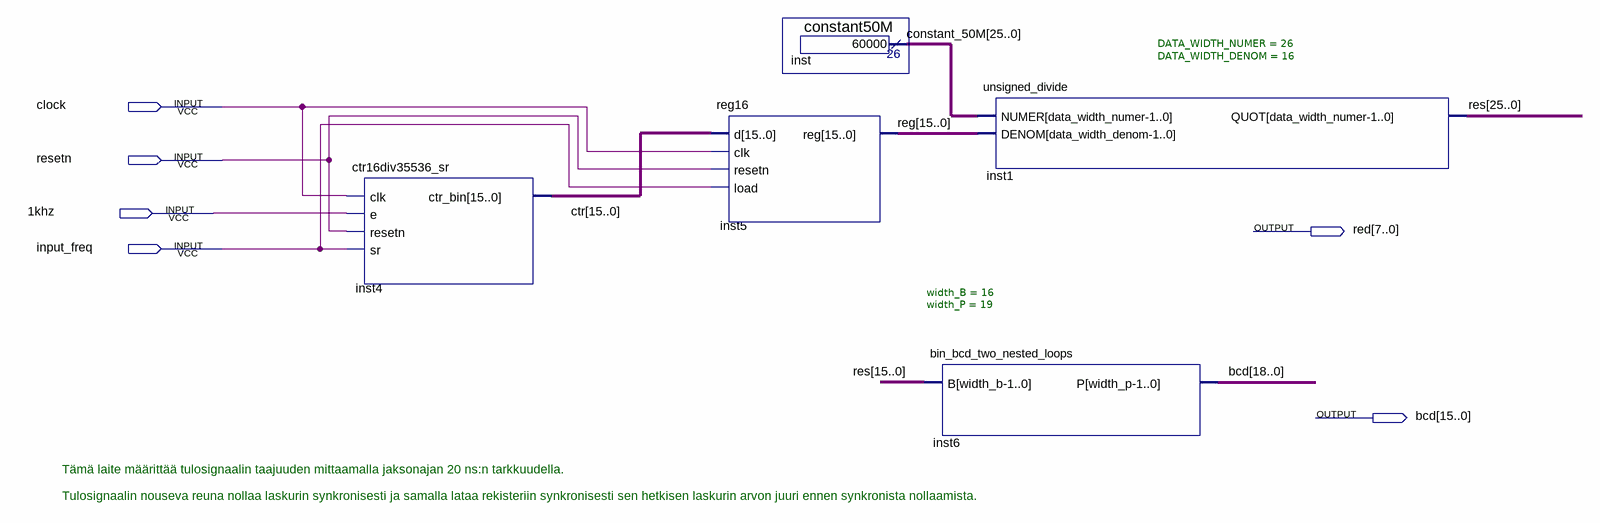
[diagram p0: schematic sheet]
// Quartus schematic freq_counter.bdf as structural Verilog: 5 symbols, 6 pins
module freq_counter (
  input  clock,
  input  resetn,
  input  \1khz ,
  input  input_freq,
  output [7:0] red,
  output [18:0] bcd
);

  wire [15:0] ctr, \reg ;
  wire [25:0] constant_50M, res;

  ctr16div35536_sr inst4 (.clk(clock), .e(\1khz ), .resetn(resetn), .sr(input_freq), .ctr_bin(ctr));
  reg16 inst5 (.d(ctr), .clk(clock), .resetn(resetn), .load(input_freq), .\reg (\reg ));
  constant50M inst (.result(constant_50M));
  bin_bcd_two_nested_loops #(.width_B(16), .width_P(19)) inst6 (.B(res[15:0]), .P(bcd));
  unsigned_divide #(.DATA_WIDTH_NUMER(26), .DATA_WIDTH_DENOM(16)) inst1 (
    .NUMER(constant_50M), .DENOM(\reg ), .QUOT(res));

  // Notes on the sheet:
  //   Tämä laite määrittää tulosignaalin taajuuden mittaamalla jaksonajan 20 ns:n tarkkuudella.
  //   Tulosignaalin nouseva reuna nollaa laskurin synkronisesti ja samalla lataa rekisteriin synkronisesti sen hetkisen laskurin arvon juuri ennen synkronista nollaamista.
endmodule
